# EAGLE schematic audiokarma (EAGLE 7.5.0)
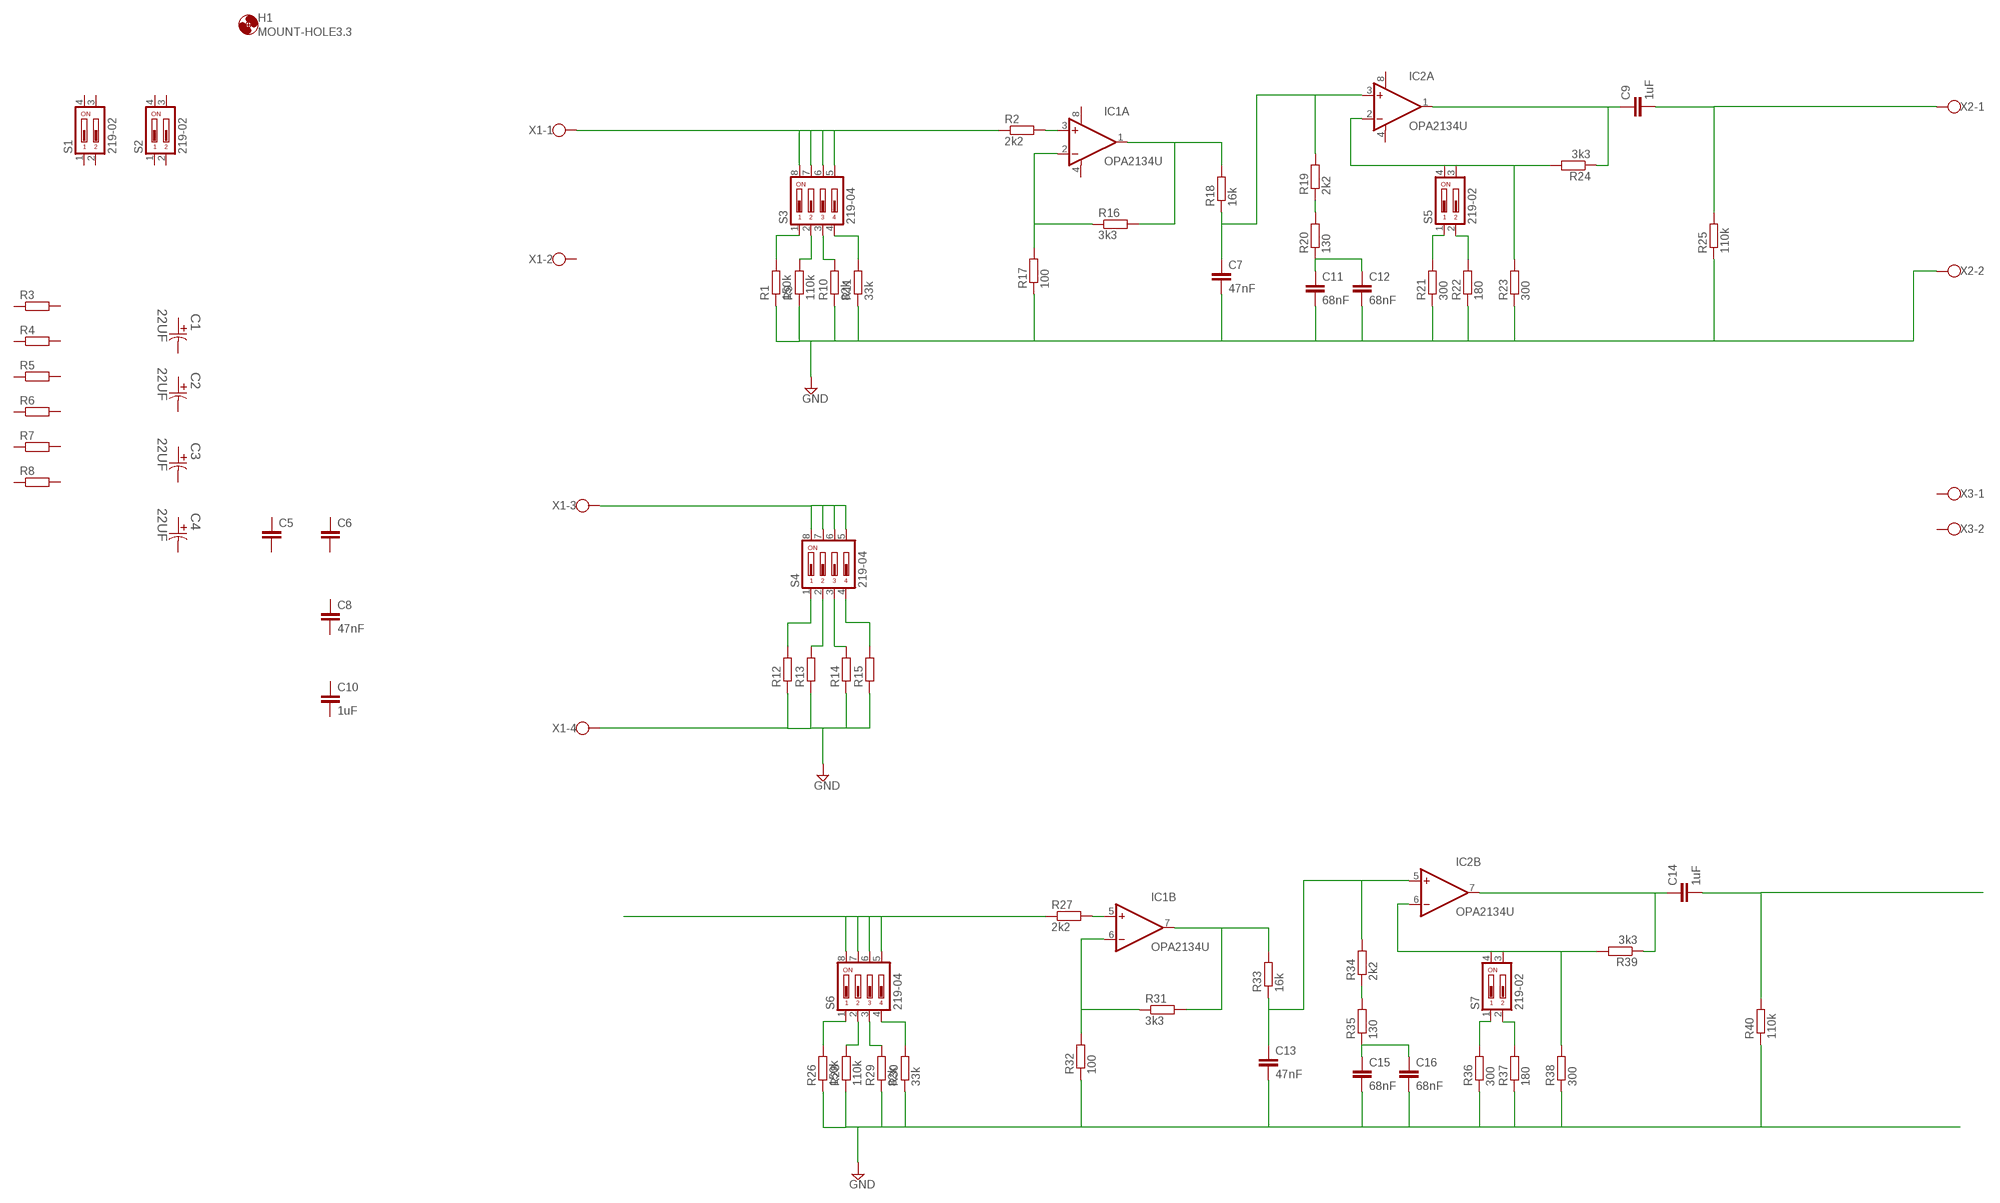
[diagram p0: schematic, sheet 1]

## Parts
C1  22UF  EEE-FC1H220P-CASE-E  [CAPAE830X650N]
C2  22UF  EEE-FC1H220P-CASE-E  [CAPAE830X650N]
C3  22UF  EEE-FC1H220P-CASE-E  [CAPAE830X650N]
C4  22UF  EEE-FC1H220P-CASE-E  [CAPAE830X650N]
C5  C-EUC0805  [C0805]
C6  C-EUC0805  [C0805]
C7  47nF  C-EU050-025X075  [C050-025X075]
C8  47nF  C-EU050-025X075  [C050-025X075]
C9  1uF  C-EU050-050X075  [C050-050X075]
C10  1uF  C-EU050-050X075  [C050-050X075]
C11  68nF  C-EU050-035X075  [C050-035X075]
C12  68nF  C-EU050-035X075  [C050-035X075]
C13  47nF  C-EU050-025X075  [C050-025X075]
C14  1uF  C-EU050-050X075  [C050-050X075]
C15  68nF  C-EU050-035X075  [C050-035X075]
C16  68nF  C-EU050-035X075  [C050-035X075]
H1  MOUNT-HOLE3.3  [3,3]
IC1  OPA2134U  [SO08]
IC2  OPA2134U  [SO08]
R1  150k  R-EU_R0805  [R0805]
R2  2k2  R-EU_R0805  [R0805]
R3  R-EU_R0805  [R0805]
R4  R-EU_R0805  [R0805]
R5  R-EU_R0805  [R0805]
R6  R-EU_R0805  [R0805]
R7  R-EU_R0805  [R0805]
R8  R-EU_R0805  [R0805]
R9  110k  R-EU_R0805  [R0805]
R10  82k  R-EU_R0805  [R0805]
R11  33k  R-EU_R0805  [R0805]
R12  R-EU_R0805  [R0805]
R13  R-EU_R0805  [R0805]
R14  R-EU_R0805  [R0805]
R15  R-EU_R0805  [R0805]
R16  3k3  R-EU_R0805  [R0805]
R17  100  R-EU_R0805  [R0805]
R18  16k  R-EU_R0805  [R0805]
R19  2k2  R-EU_R0805  [R0805]
R20  130  R-EU_R0805  [R0805]
R21  300  R-EU_R0805  [R0805]
R22  180  R-EU_R0805  [R0805]
R23  300  R-EU_R0805  [R0805]
R24  3k3  R-EU_R0805  [R0805]
R25  110k  R-EU_R0805  [R0805]
R26  150k  R-EU_R0805  [R0805]
R27  2k2  R-EU_R0805  [R0805]
R28  110k  R-EU_R0805  [R0805]
R29  82k  R-EU_R0805  [R0805]
R30  33k  R-EU_R0805  [R0805]
R31  3k3  R-EU_R0805  [R0805]
R32  100  R-EU_R0805  [R0805]
R33  16k  R-EU_R0805  [R0805]
R34  2k2  R-EU_R0805  [R0805]
R35  130  R-EU_R0805  [R0805]
R36  300  R-EU_R0805  [R0805]
R37  180  R-EU_R0805  [R0805]
R38  300  R-EU_R0805  [R0805]
R39  3k3  R-EU_R0805  [R0805]
R40  110k  R-EU_R0805  [R0805]
S1  219-02  [CTS-219-02]
S2  219-02  [CTS-219-02]
S3  219-04  [CTS-219-04]
S4  219-04  [CTS-219-04]
S5  219-02  [CTS-219-02]
S6  219-04  [CTS-219-04]
S7  219-02  [CTS-219-02]
X1  W237-4  [W237-4]
X2  W237-102  [W237-102]
X3  W237-102  [W237-102]

## Nets
GND: C7.2 C11.2 C12.2 C13.2 C15.2 C16.2 R1.1 R9.1 R10.1 R11.1 R12.1 R13.1 R14.1 R15.1 R17.1 R21.1 R22.1 R23.1 R25.1 R26.1 R28.1 R29.1 R30.1 R32.1 R36.1 R37.1 R38.1 R40.1 X1.4 X2.2
N$1: R1.2 S3.1
N$2: R9.2 S3.2
N$3: R10.2 S3.3
N$4: R11.2 S3.4
N$5: R12.2 S4.1
N$6: R2.1 S3.5 S3.6 S3.7 S3.8 X1.1
N$7: R13.2 S4.2
N$8: R14.2 S4.3
N$9: R15.2 S4.4
N$10: S4.5 S4.6 S4.7 S4.8 X1.3
N$12: C9.1 IC2.1(A:OUT) R24.1
N$13: R26.2 S6.1
N$14: IC1.3(A:+IN) R2.2
N$15: IC1.2(A:-IN) R16.1 R17.2
N$16: C9.2 R25.2 X2.1
N$17: IC1.1(A:OUT) R16.2 R18.2
N$18: C7.1 IC2.3(A:+IN) R18.1 R19.2
N$19: R28.2 S6.2
N$20: R29.2 S6.3
N$21: R30.2 S6.4
N$22: C11.1 C12.1 R20.1
N$23: R19.1 R20.2
N$24: R27.1 S6.5 S6.6 S6.7 S6.8
N$25: IC1.5(B:+IN) R27.2
N$26: IC2.2(A:-IN) R23.2 R24.2 S5.3 S5.4
N$27: R21.2 S5.1
N$28: R22.2 S5.2
N$29: IC1.6(B:-IN) R31.1 R32.2
N$30: IC1.7(B:OUT) R31.2 R33.2
N$31: C13.1 IC2.5(B:+IN) R33.1 R34.2
N$32: C15.1 C16.1 R35.1
N$33: R34.1 R35.2
N$34: IC2.6(B:-IN) R38.2 R39.2 S7.3 S7.4
N$35: R36.2 S7.1
N$36: R37.2 S7.2
N$37: C14.1 IC2.7(B:OUT) R39.1
N$38: C14.2 R40.2
Unconnected: C1.1 C1.2 C2.1 C2.2 C3.1 C3.2 C4.1 C4.2 C5.1 C5.2 C6.1 C6.2 C8.1 C8.2 C10.1 C10.2 R3.1 R3.2 R4.1 R4.2 R5.1 R5.2 R6.1 R6.2 R7.1 R7.2 R8.1 R8.2 S1.1 S1.2 S1.3 S1.4 S2.1 S2.2 S2.3 S2.4 X1.2 X3.1 X3.2

## Power pins joined to a net without a drawn wire
V+: IC1.8(A:V+) IC2.8(A:V+)
V-: IC1.4(A:V-) IC2.4(A:V-)

## Library data of the parts
C1-C4 = Panasonic-EEE0_EEE1_EEE2_EEEFC:EEE-: Aluminum Electrolytic Capacitors,Surface Mount Type; MPN: EEE-FC1H220P; OC_FARNELL: 9694579; OC_NEWARK: 91K9619; PACKAGE: CASE-E; SUPPLIER: PANASONIC; TOLERANCE: 20%; VOLTAGERATING: 50V
C5-C16 = rcl:C-EU: CAPACITOR, European symbol
H1 = holes:MOUNT-HOLE: MOUNTING HOLE with drill center marker
IC1 IC2 = burr-brown:OPA2134: Operational Amplifier; MF: TEXAS INSTRUMENTS; MPN: OPA2134UA; OC_FARNELL: 1206935; OC_NEWARK: 35C1847
R1-R40 = rcl:R-EU_: RESISTOR, European symbol
S1 S2 S5 S7 = switch-dil:219-02*: Surface Mount DIP Switch Series 219 SMT CTS Electronic Components Sourc: www.ctscorp.com; OC_FARNELL: unknown; OC_NEWARK: unknown
S3 S4 S6 = switch-dil:219-04*: Surface Mount DIP Switch Series 219 SMT CTS Electronic Components Sourc: www.ctscorp.com; OC_FARNELL: unknown; OC_NEWARK: unknown
X1 = con-wago-500:W237-4: WAGO SCREW CLAMP; OC_FARNELL: unknown; OC_NEWARK: unknown
X2 X3 = con-wago-500:W237-102: WAGO SCREW CLAMP; MPN: 237-102; OC_FARNELL: unknown; OC_NEWARK: 70K9898